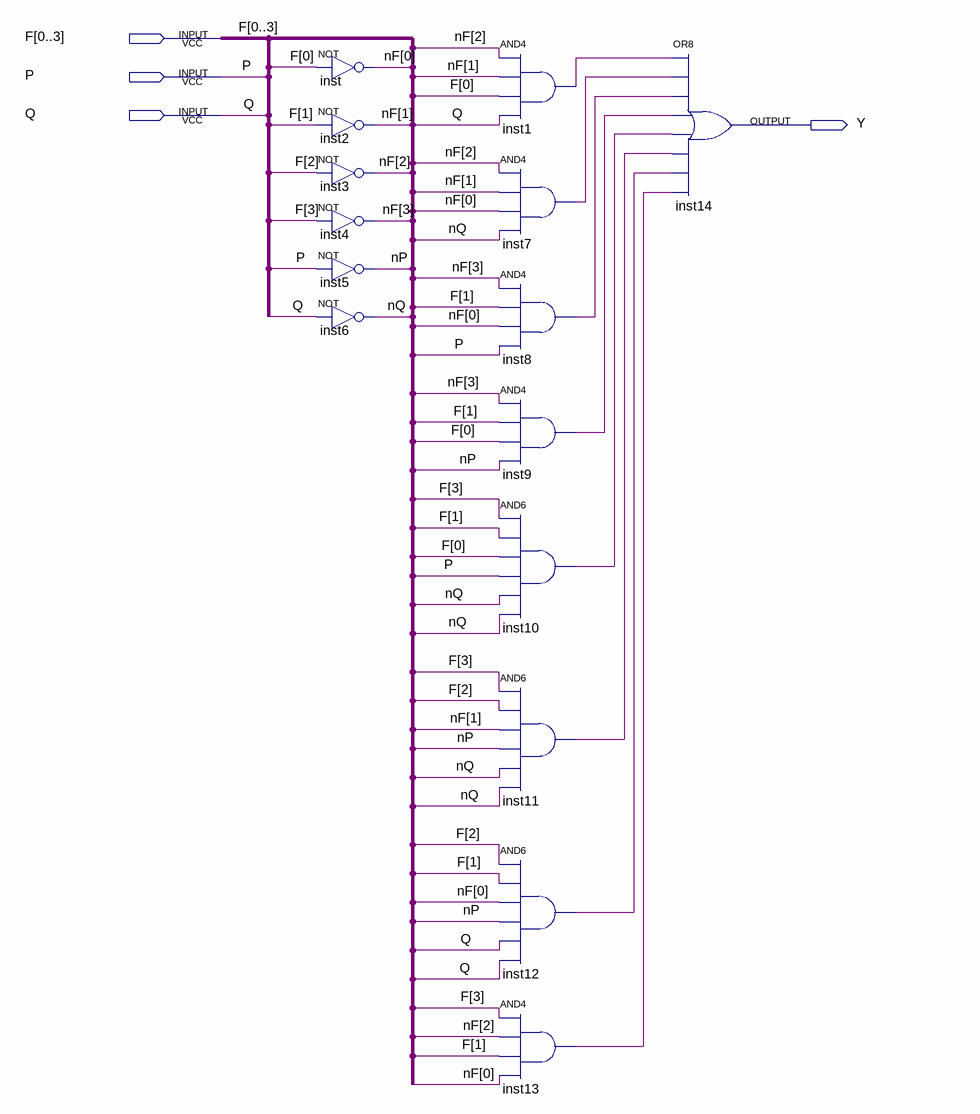
[diagram p0: schematic sheet]
// Quartus schematic Lnq.bdf as structural Verilog: 15 symbols, 4 pins
module Lnq (
  input  [0:3] F,
  input  P,
  input  Q,
  output Y
);

  wire inst1_out, inst7_out, inst8_out, inst9_out, inst10_out, inst11_out, inst12_out, inst13_out, nP, nQ;
  wire [3:0] nF;

  not inst (nF[0], F[0]);
  not inst2 (nF[1], F[1]);
  not inst3 (nF[2], F[2]);
  not inst4 (nF[3], F[3]);
  not inst5 (nP, P);
  not inst6 (nQ, Q);
  and inst1 (inst1_out, nF[2], nF[1], F[0], Q);
  and inst7 (inst7_out, nF[2], nF[1], nF[0], nQ);
  and inst8 (inst8_out, nF[3], F[1], nF[0], P);
  and inst9 (inst9_out, nF[3], F[1], F[0], nP);
  and inst10 (inst10_out, F[3], F[1], F[0], P, nQ, nQ);
  and inst11 (inst11_out, F[3], F[2], nF[1], nP, nQ, nQ);
  and inst12 (inst12_out, F[2], F[1], nF[0], nP, Q, Q);
  and inst13 (inst13_out, F[3], nF[2], F[1], nF[0]);
  or inst14 (Y, inst1_out, inst7_out, inst8_out, inst9_out, inst10_out, inst11_out, inst12_out, inst13_out);
endmodule
